# EAGLE design DaysSince (EAGLE 6.3)
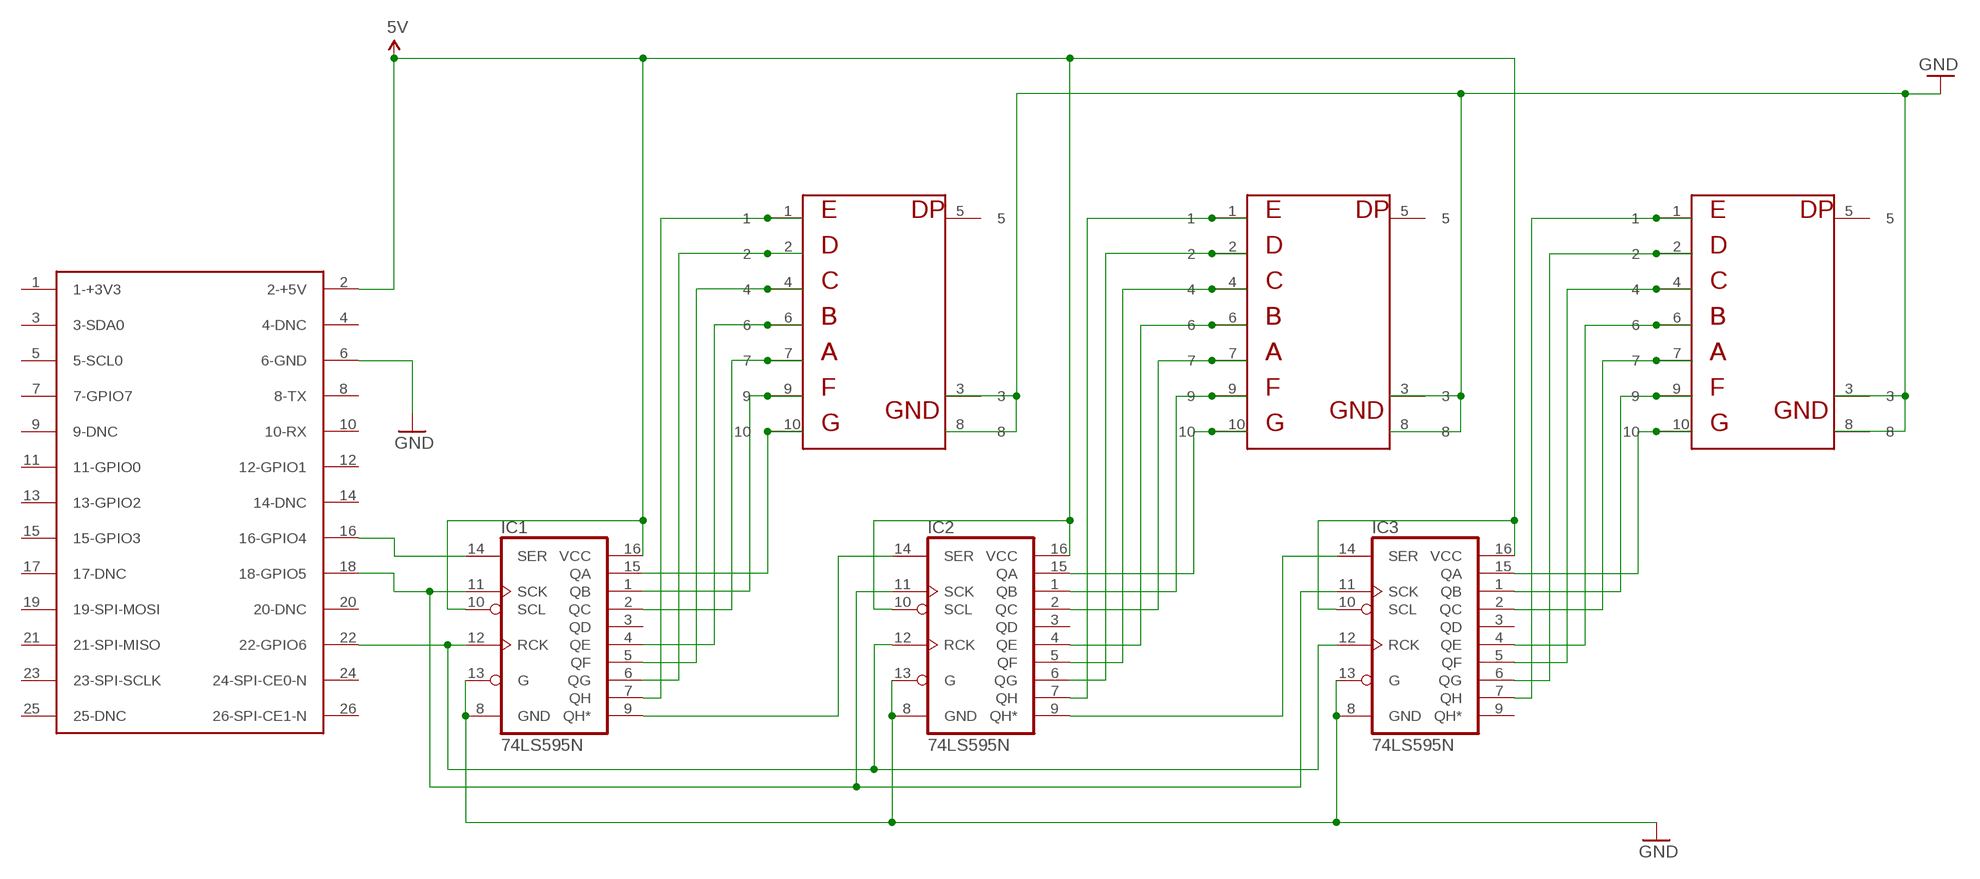
[diagram p0: schematic, sheet 1]

## Parts
IC1  74LS595N  [DIL16]
IC2  74LS595N  [DIL16]
IC3  74LS595N  [DIL16]
LED1  7SG100012AG  [7SG100012AG]
LED2  7SG100012AG  [7SG100012AG]
LED3  7SG100012AG  [7SG100012AG]
U$1  RASPBERRY-PI  [RASPBERRY-PI]

## Nets
5V: IC1.10(SCL) IC1.16(VCC) IC2.10(SCL) IC2.16(VCC) IC3.10(SCL) IC3.16(VCC) U$1.2(2-+5V)
GND: IC1.8(GND) IC1.13(G) IC2.8(GND) IC2.13(G) IC3.8(GND) IC3.13(G) LED1.3 LED1.8 LED2.3 LED2.8 LED3.3 LED3.8 U$1.6(6-GND)
N$1: IC1.9(QH*) IC2.14(SER)
N$2: IC2.9(QH*) IC3.14(SER)
N$3: IC2.4(QE) LED2.6
N$4: IC1.12(RCK) IC2.12(RCK) IC3.12(RCK) U$1.22(22-GPIO6)
N$5: IC1.11(SCK) IC2.11(SCK) IC3.11(SCK) U$1.18(18-GPIO5)
N$6: IC1.14(SER) U$1.16(16-GPIO4)
N$7: IC2.2(QC) LED2.7
N$8: IC2.1(QB) LED2.9
N$9: IC1.7(QH) LED1.1
N$10: IC1.6(QG) LED1.2
N$11: IC1.5(QF) LED1.4
N$12: IC1.4(QE) LED1.6
N$13: IC1.2(QC) LED1.7
N$14: IC1.1(QB) LED1.9
N$15: IC1.15(QA) LED1.10
N$16: IC2.7(QH) LED2.1
N$17: IC2.6(QG) LED2.2
N$18: IC2.5(QF) LED2.4
N$19: IC2.15(QA) LED2.10
N$20: IC3.7(QH) LED3.1
N$21: IC3.6(QG) LED3.2
N$22: IC3.5(QF) LED3.4
N$23: IC3.4(QE) LED3.6
N$24: IC3.2(QC) LED3.7
N$25: IC3.1(QB) LED3.9
N$26: IC3.15(QA) LED3.10
Unconnected: IC1.3(QD) IC2.3(QD) IC3.3(QD) IC3.9(QH*) LED1.5 LED2.5 LED3.5 U$1.1(1-+3V3) U$1.3(3-SDA0) U$1.4(4-DNC) U$1.5(5-SCL0) U$1.7(7-GPIO7) U$1.8(8-TX) U$1.9(9-DNC) U$1.10(10-RX) U$1.11(11-GPIO0) U$1.12(12-GPIO1) U$1.13(13-GPIO2) U$1.14(14-DNC) U$1.15(15-GPIO3) U$1.17(17-DNC) U$1.19(19-SPI-MOSI) U$1.20(20-DNC) U$1.21(21-SPI-MISO) U$1.23(23-SPI-SCLK) U$1.24(24-SPI-CE0-N) U$1.25(25-DNC) U$1.26(26-SPI-CE1-N)

## Library data of the parts
IC1-IC3 = SparkFun-DigitalIC:74*595: 8-bit SHIFT REGISTER, output latch
LED1-LED3 = Benchoff:7SG100012AG
U$1 = RaspberryPi:RASPBERRY-PI: Raspberry Pi Board <http://www.raspberrypi.org/> Jacques Lagnel V1.0 (beta) 2012 Board dimension: Forum 3D model <http://www.raspberrypi.org/forum/general-discussion/mechanical-profile-3d-models?value=3d%20model&type=1&include=1&search=1&ret=all> The GPIO Connector (P1): http://elinux.org/RPi_Low-level_peripherals

## Board
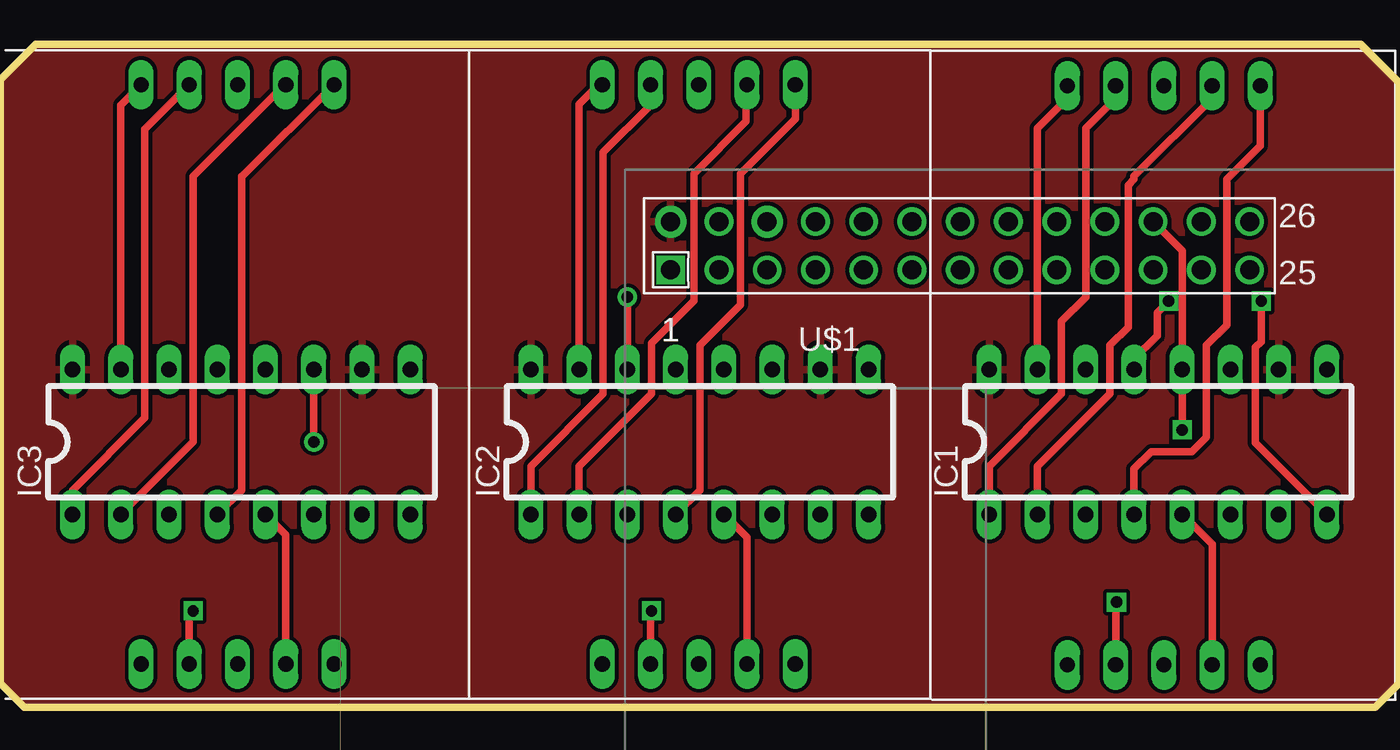
[diagram p1: board, top side]
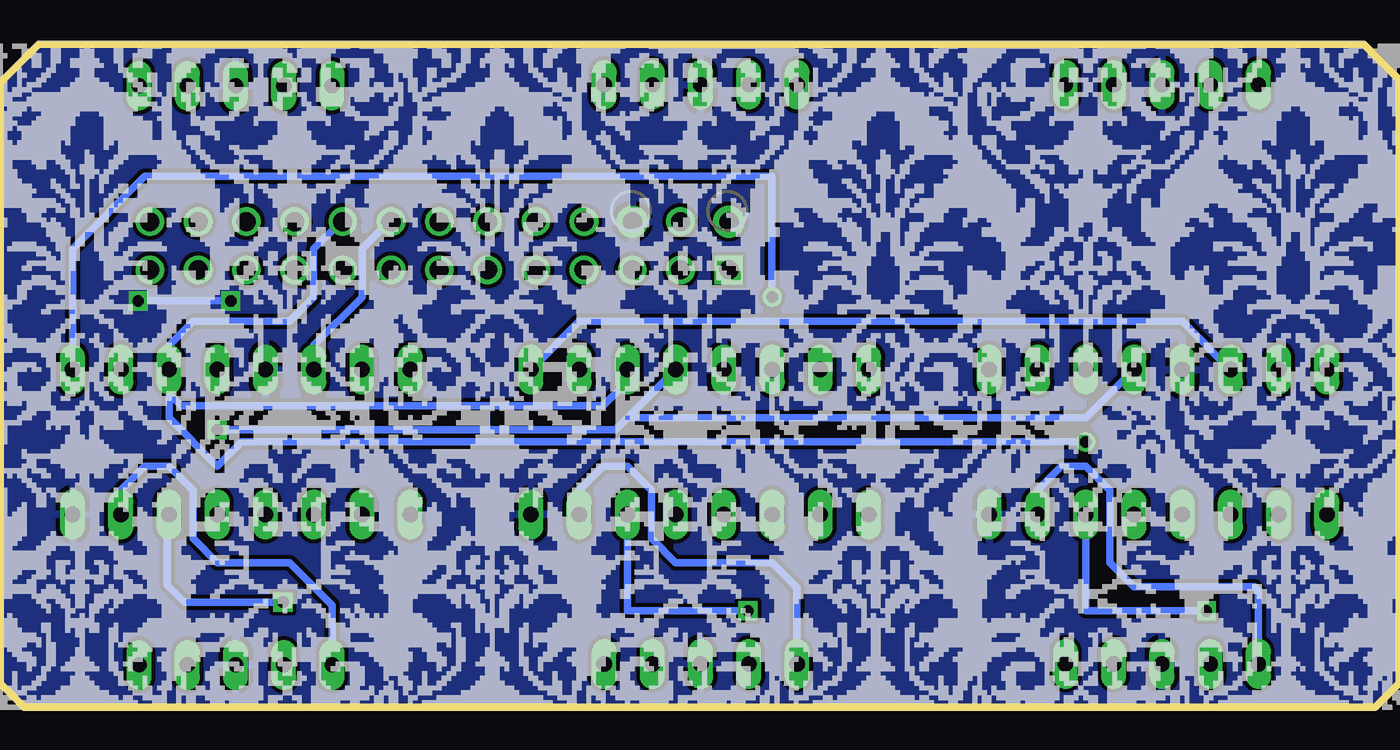
[diagram p2: board, bottom side, seen from below]

No outline drawn. Coordinates in mm, seen from the top.
Copper layers (1*16): Top 0.035mm / dielectric 1.5mm / Bottom 0.035mm
Design rules "default": minimum track width 10mil, minimum drill 24mil, track to track 8mil, track to pad 8mil, pad to pad 8mil, via to via 8mil, smd to smd 8mil, copper to edge 40mil, drill to drill 8mil, minimum pad ring 10mil, minimum via ring 8mil, stop-mask expansion 4mil, vias tented up to drill 0mil, thermal gap 10mil
Milling: 8 lines

### Footprints (pad centres in the part's own frame; a part is rotated, then mirrored left to right if it is on the bottom)
DIL16 = drill 0.813 long: 1 -8.89,-3.81; 2 -6.35,-3.81; 3 -3.81,-3.81; 4 -1.27,-3.81; 5 1.27,-3.81; 6 3.81,-3.81; 7 6.35,-3.81; 8 8.89,-3.81; 9 8.89,3.81; 10 6.35,3.81; 11 3.81,3.81; 12 1.27,3.81; 13 -1.27,3.81; 14 -3.81,3.81; 15 -6.35,3.81; 16 -8.89,3.81
7SG100012AG = drill 0.8 long: 1 -5.08,-15.24; 2 -2.54,-15.24; 3 0,-15.24; 4 2.54,-15.24; 5 5.08,-15.24; 6 5.08,15.24; 7 2.54,15.24; 8 0,15.24; 9 -2.54,15.24; 10 -5.08,15.24
RASPBERRY-PI = drill 1 square: 1 0,0 | drill 1 pad 1.676: 2 0,2.54; 6 5.08,2.54 | drill 1: 3 2.54,0; 4 2.54,2.54; 5 5.08,0; 7 7.62,0; 8 7.62,2.54; 9 10.16,0; 10 10.16,2.54; 11 12.7,0; 12 12.7,2.54; 13 15.24,0; 14 15.24,2.54; 15 17.78,0; 16 17.78,2.54; 17 20.32,0; 18 20.32,2.54; 19 22.86,0; 20 22.86,2.54; 21 25.4,0; 22 25.4,2.54; 23 27.94,0; 24 27.94,2.54; 25 30.48,0; 26 30.48,2.54

### Placement (x,y rotation side)
IC1  71.37,42.16 0 top
IC2  47.24,42.16 0 top
IC3  23.11,42.16 0 top
LED1  71.68,45.67 0 top
LED2  47.19,45.72 0 top
LED3  22.91,45.72 0 top
U$1  45.71,51.22 0 top

### Tracks (layer width: path | path; a pad name or v marks a point on that pad's centre or on a via)
5V
  pour Top: 10.41,61.21 10.41,29.46 11.68,28.19 82.8,28.19 84.07,29.46 84.07,61.06 82.04,63.09 12.29,63.09
GND  (via drill 0.6)
  Top 0.406: IC1.13 70.1,46.53 71.32,47.75 71.32,48.97 v71.93,49.58 | v76.81,49.58 76.81,47.45 76.5,47.14 76.5,42.11 IC1.8
  Bottom 0.406: v71.93,49.58 v76.81,49.58
  pour Bottom: 10.41,61.21 10.41,29.46 11.68,28.19 82.8,28.19 84.07,29.46 84.07,61.21 83.92,61.21 82.04,63.09 12.29,63.09
N$1  (via drill 0.61)
  Top 0.406: v43.43,49.78 IC2.14
  Bottom 0.406: v43.43,49.78 43.43,56.13 76.45,56.13 80.26,52.32 IC1.9
N$2
  Bottom 0.406: IC3.14 21.84,48.51 53.59,48.51 IC2.9
N$3
  Top 0.406: IC2.4 47.24,39.62 47.24,47.24 49.38,49.38 49.38,56.29 52.27,59.18 LED2.6
N$4  (via drill 0.6)
  Top 0.406: U$1.22 72.64,52.23 IC1.12 v72.64,42.8
  Bottom 0.406: IC2.12 51.05,43.43 | 51.05,43.43 51.69,42.8 v72.64,42.8 | IC3.12 26.92,43.43 51.05,43.43
N$5  (via drill 0.61)
  Top 0.406: v26.92,42.16 IC3.11
  Bottom 0.406: U$1.18 66.13,53.76 67.56,52.32 67.56,49.78 68.83,48.51 73.91,48.51 75.18,47.24 IC1.11 75.18,44.7 | IC2.11 51.05,45.34 52.32,44.07 74.55,44.07 75.18,44.7 | v26.92,42.16 71.37,42.16 72.64,40.89 75.18,43.43 75.18,44.7
N$6
  Bottom 0.406: U$1.16 63.59,53.76 65.02,52.32 65.02,49.78 67.56,47.24 IC1.14
N$7
  Top 0.406: IC2.2 40.89,40.89 44.7,44.7 44.7,47.35 46.94,49.58 46.94,56.29 49.68,59.03 49.68,60.91 LED2.7
N$8
  Top 0.406: LED2.9 44.65,59.89 42.16,57.4 42.16,44.7 38.35,40.89 IC2.1
N$9
  Bottom 0.406: LED1.1 66.6,33.58 68.83,35.81 72.64,35.81 73.91,37.08 73.91,39.62 75.18,40.89 76.45,40.89 77.72,39.62 IC1.7
N$10  (via drill 0.6)
  Top 0.406: LED1.2 69.14,33.68 v69.19,33.73
  Bottom 0.406: v69.19,33.73 74.37,33.73 75.29,34.65 75.29,38.25 IC1.6
N$11
  Top 0.406: LED1.4 74.22,36.78 IC1.5
N$12
  Top 0.406: LED1.6 76.76,57.76 74.98,55.98 74.98,48.31 73.91,47.24 73.91,42.42 73.15,41.66 71.02,41.66 70.1,40.74 IC1.4
N$13
  Top 0.406: IC1.2 65.02,40.89 68.83,44.7 68.83,47.24 69.8,48.21 69.8,55.68 70.1,55.98 70.1,56.13 74.22,60.25 LED1.7
N$14
  Top 0.406: LED1.9 69.14,60.25 67.56,58.67 67.56,49.78 66.29,48.51 66.29,44.7 62.48,40.89 IC1.1
N$15
  Top 0.406: LED1.10 66.6,60.25 65.02,58.67 IC1.15
N$16
  Bottom 0.406: LED2.1 42.11,34.49 43.43,35.81 48.51,35.81 49.78,37.08 49.78,39.62 51.05,40.89 52.32,40.89 53.59,39.62 IC2.7
N$17  (via drill 0.6)
  Top 0.406: LED2.2 44.65,33.22 v44.7,33.27
  Bottom 0.406: v44.7,33.27 51.05,33.27 IC2.6
N$18
  Top 0.406: LED2.4 49.73,37.13 IC2.5
N$19
  Top 0.406: LED2.10 41.91,60.96 40.89,59.94 IC2.15
N$20
  Bottom 0.406: LED3.1 17.83,34.34 18.03,34.54 24.38,34.54 25.65,35.81 25.65,39.62 26.92,40.89 28.19,40.89 29.46,39.62 IC3.7
N$21  (via drill 0.6)
  Top 0.406: LED3.2 20.37,33.07 v20.57,33.27
  Bottom 0.406: v20.57,33.27 26.92,33.27 IC3.6
N$22
  Top 0.406: LED3.4 25.45,37.29 IC3.5
N$23
  Top 0.406: LED3.6 23.16,56.13 23.11,56.13 23.11,39.62 IC3.4
N$24
  Top 0.406: IC3.2 20.57,42.16 20.57,56.13 25.4,60.96 LED3.7
N$25
  Top 0.406: LED3.9 18.03,58.62 18.03,43.43 14.22,39.62 IC3.1
N$26
  Top 0.406: LED3.10 16.76,59.89 IC3.15